# Altium project RP2040.PrjPcb
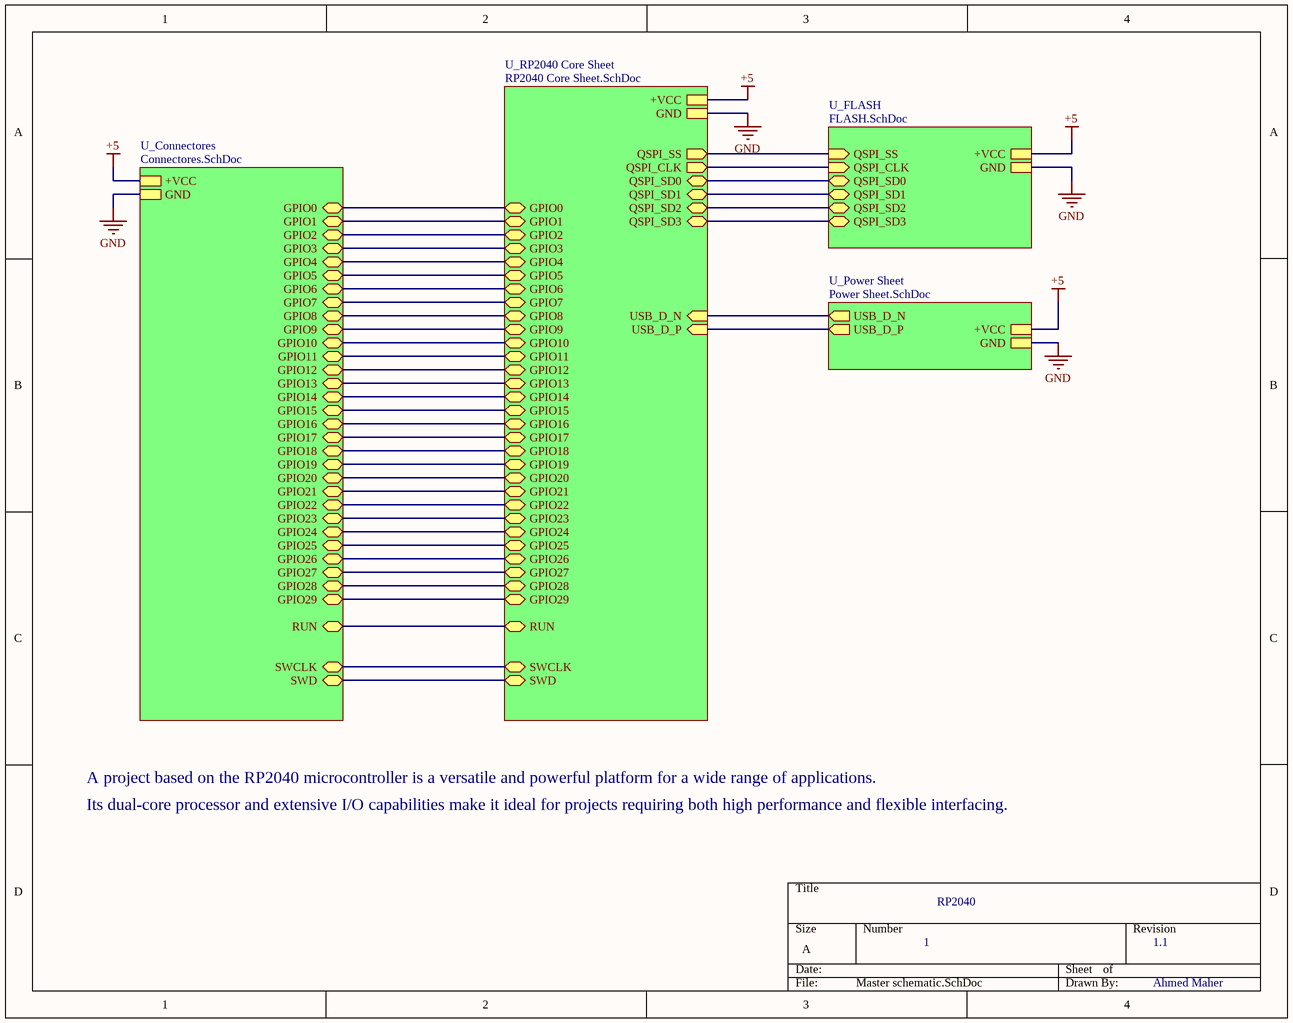
[diagram p0: Master schematic.SchDoc]
5 sheets, 30 parts. Net scope: hierarchical (ports join the sheet entries above them; power ports are global).
Board file: PCB.PcbDoc
Sheets:
  Master schematic.SchDoc
    U_RP2040 Core Sheet = RP2040 Core Sheet.SchDoc
    U_Connectores = Connectores.SchDoc
    U_FLASH = FLASH.SchDoc
    U_Power Sheet = Power Sheet.SchDoc

## Sheet Master schematic.SchDoc
size A; SheetNumber: 1; SheetTotal: 5

### Sub-sheets
U_Connectores = Connectores.SchDoc: +VCC, GND, GPIO0 (bidir), GPIO1 (bidir), GPIO2 (bidir), GPIO3 (bidir), GPIO4 (bidir), GPIO5 (bidir), GPIO6 (bidir), GPIO7 (bidir), GPIO8 (bidir), GPIO9 (bidir), GPIO10 (bidir), GPIO11 (bidir), GPIO12 (bidir), GPIO13 (bidir), GPIO14 (bidir), GPIO15 (bidir), SWCLK (bidir), SWD (bidir), RUN (bidir), GPIO16 (bidir), GPIO18 (bidir), GPIO19 (bidir), GPIO20 (bidir), GPIO21 (bidir), GPIO22 (bidir), GPIO23 (bidir), GPIO24 (bidir), GPIO25 (bidir), GPIO27 (bidir), GPIO28 (bidir), GPIO29 (bidir), GPIO17 (bidir), GPIO26 (bidir)
U_FLASH = FLASH.SchDoc: QSPI_SS (in), QSPI_CLK (in), QSPI_SD0 (bidir), QSPI_SD1 (bidir), QSPI_SD2 (bidir), QSPI_SD3 (bidir), +VCC, GND
U_Power Sheet = Power Sheet.SchDoc: USB_D_P (out), USB_D_N (out), +VCC, GND
U_RP2040 Core Sheet = RP2040 Core Sheet.SchDoc: USB_D_P (in), USB_D_N (in), QSPI_SS (out), QSPI_SD0 (bidir), QSPI_SD1 (bidir), QSPI_SD2 (bidir), QSPI_SD3 (bidir), QSPI_CLK (out), +VCC, GND, GPIO0 (bidir), GPIO1 (bidir), GPIO2 (bidir), GPIO3 (bidir), GPIO4 (bidir), GPIO5 (bidir), GPIO6 (bidir), GPIO7 (bidir), GPIO8 (bidir), GPIO9 (bidir), GPIO10 (bidir), GPIO11 (bidir), GPIO12 (bidir), GPIO13 (bidir), GPIO14 (bidir), GPIO15 (bidir), GPIO16 (bidir), GPIO18 (bidir), GPIO19 (bidir), GPIO20 (bidir), GPIO21 (bidir), GPIO22 (bidir), GPIO23 (bidir), GPIO24 (bidir), GPIO25 (bidir), GPIO17 (bidir), GPIO27 (bidir), GPIO28 (bidir), GPIO29 (bidir), GPIO26 (bidir), RUN (bidir), SWCLK (bidir), SWD (bidir)

### Nets
+5: sheet U_RP2040 Core Sheet/+VCC, sheet U_Connectores/+VCC, sheet U_FLASH/+VCC, sheet U_Power Sheet/+VCC
GND: sheet U_RP2040 Core Sheet/GND, sheet U_Connectores/GND, sheet U_FLASH/GND, sheet U_Power Sheet/GND
GPIO0: sheet U_RP2040 Core Sheet/GPIO0, sheet U_Connectores/GPIO0
GPIO1: sheet U_RP2040 Core Sheet/GPIO1, sheet U_Connectores/GPIO1
GPIO2: sheet U_RP2040 Core Sheet/GPIO2, sheet U_Connectores/GPIO2
GPIO3: sheet U_RP2040 Core Sheet/GPIO3, sheet U_Connectores/GPIO3
GPIO4: sheet U_RP2040 Core Sheet/GPIO4, sheet U_Connectores/GPIO4
GPIO5: sheet U_RP2040 Core Sheet/GPIO5, sheet U_Connectores/GPIO5
GPIO6: sheet U_RP2040 Core Sheet/GPIO6, sheet U_Connectores/GPIO6
GPIO7: sheet U_RP2040 Core Sheet/GPIO7, sheet U_Connectores/GPIO7
GPIO8: sheet U_RP2040 Core Sheet/GPIO8, sheet U_Connectores/GPIO8
GPIO9: sheet U_RP2040 Core Sheet/GPIO9, sheet U_Connectores/GPIO9
GPIO10: sheet U_RP2040 Core Sheet/GPIO10, sheet U_Connectores/GPIO10
GPIO11: sheet U_RP2040 Core Sheet/GPIO11, sheet U_Connectores/GPIO11
GPIO12: sheet U_RP2040 Core Sheet/GPIO12, sheet U_Connectores/GPIO12
GPIO13: sheet U_RP2040 Core Sheet/GPIO13, sheet U_Connectores/GPIO13
GPIO14: sheet U_RP2040 Core Sheet/GPIO14, sheet U_Connectores/GPIO14
GPIO15: sheet U_RP2040 Core Sheet/GPIO15, sheet U_Connectores/GPIO15
GPIO16: sheet U_RP2040 Core Sheet/GPIO16, sheet U_Connectores/GPIO16
GPIO17: sheet U_RP2040 Core Sheet/GPIO17, sheet U_Connectores/GPIO17
GPIO18: sheet U_RP2040 Core Sheet/GPIO18, sheet U_Connectores/GPIO18
GPIO19: sheet U_RP2040 Core Sheet/GPIO19, sheet U_Connectores/GPIO19
GPIO20: sheet U_RP2040 Core Sheet/GPIO20, sheet U_Connectores/GPIO20
GPIO21: sheet U_RP2040 Core Sheet/GPIO21, sheet U_Connectores/GPIO21
GPIO22: sheet U_RP2040 Core Sheet/GPIO22, sheet U_Connectores/GPIO22
GPIO23: sheet U_RP2040 Core Sheet/GPIO23, sheet U_Connectores/GPIO23
GPIO24: sheet U_RP2040 Core Sheet/GPIO24, sheet U_Connectores/GPIO24
GPIO25: sheet U_RP2040 Core Sheet/GPIO25, sheet U_Connectores/GPIO25
GPIO26: sheet U_RP2040 Core Sheet/GPIO26, sheet U_Connectores/GPIO26
GPIO27: sheet U_RP2040 Core Sheet/GPIO27, sheet U_Connectores/GPIO27
GPIO28: sheet U_RP2040 Core Sheet/GPIO28, sheet U_Connectores/GPIO28
GPIO29: sheet U_RP2040 Core Sheet/GPIO29, sheet U_Connectores/GPIO29
QSPI_CLK: sheet U_RP2040 Core Sheet/QSPI_CLK, sheet U_FLASH/QSPI_CLK
QSPI_SD0: sheet U_RP2040 Core Sheet/QSPI_SD0, sheet U_FLASH/QSPI_SD0
QSPI_SD1: sheet U_RP2040 Core Sheet/QSPI_SD1, sheet U_FLASH/QSPI_SD1
QSPI_SD2: sheet U_RP2040 Core Sheet/QSPI_SD2, sheet U_FLASH/QSPI_SD2
QSPI_SD3: sheet U_RP2040 Core Sheet/QSPI_SD3, sheet U_FLASH/QSPI_SD3
QSPI_SS: sheet U_RP2040 Core Sheet/QSPI_SS, sheet U_FLASH/QSPI_SS
RUN: sheet U_RP2040 Core Sheet/RUN, sheet U_Connectores/RUN
SWCLK: sheet U_RP2040 Core Sheet/SWCLK, sheet U_Connectores/SWCLK
SWD: sheet U_RP2040 Core Sheet/SWD, sheet U_Connectores/SWD
USB_D_N: sheet U_RP2040 Core Sheet/USB_D_N, sheet U_Power Sheet/USB_D_N
USB_D_P: sheet U_RP2040 Core Sheet/USB_D_P, sheet U_Power Sheet/USB_D_P

### Notes on the sheet
- A project based on the RP2040 microcontroller is a versatile and powerful platform for a wide range of applications.
- Its dual-core processor and extensive I/O capabilities make it ideal for projects requiring both high performance and flexible interfacing.
- RP2040
- 1
- 1.1
- Ahmed Maher

## Sheet RP2040 Core Sheet.SchDoc
size B; SheetNumber: 3; SheetTotal: 5
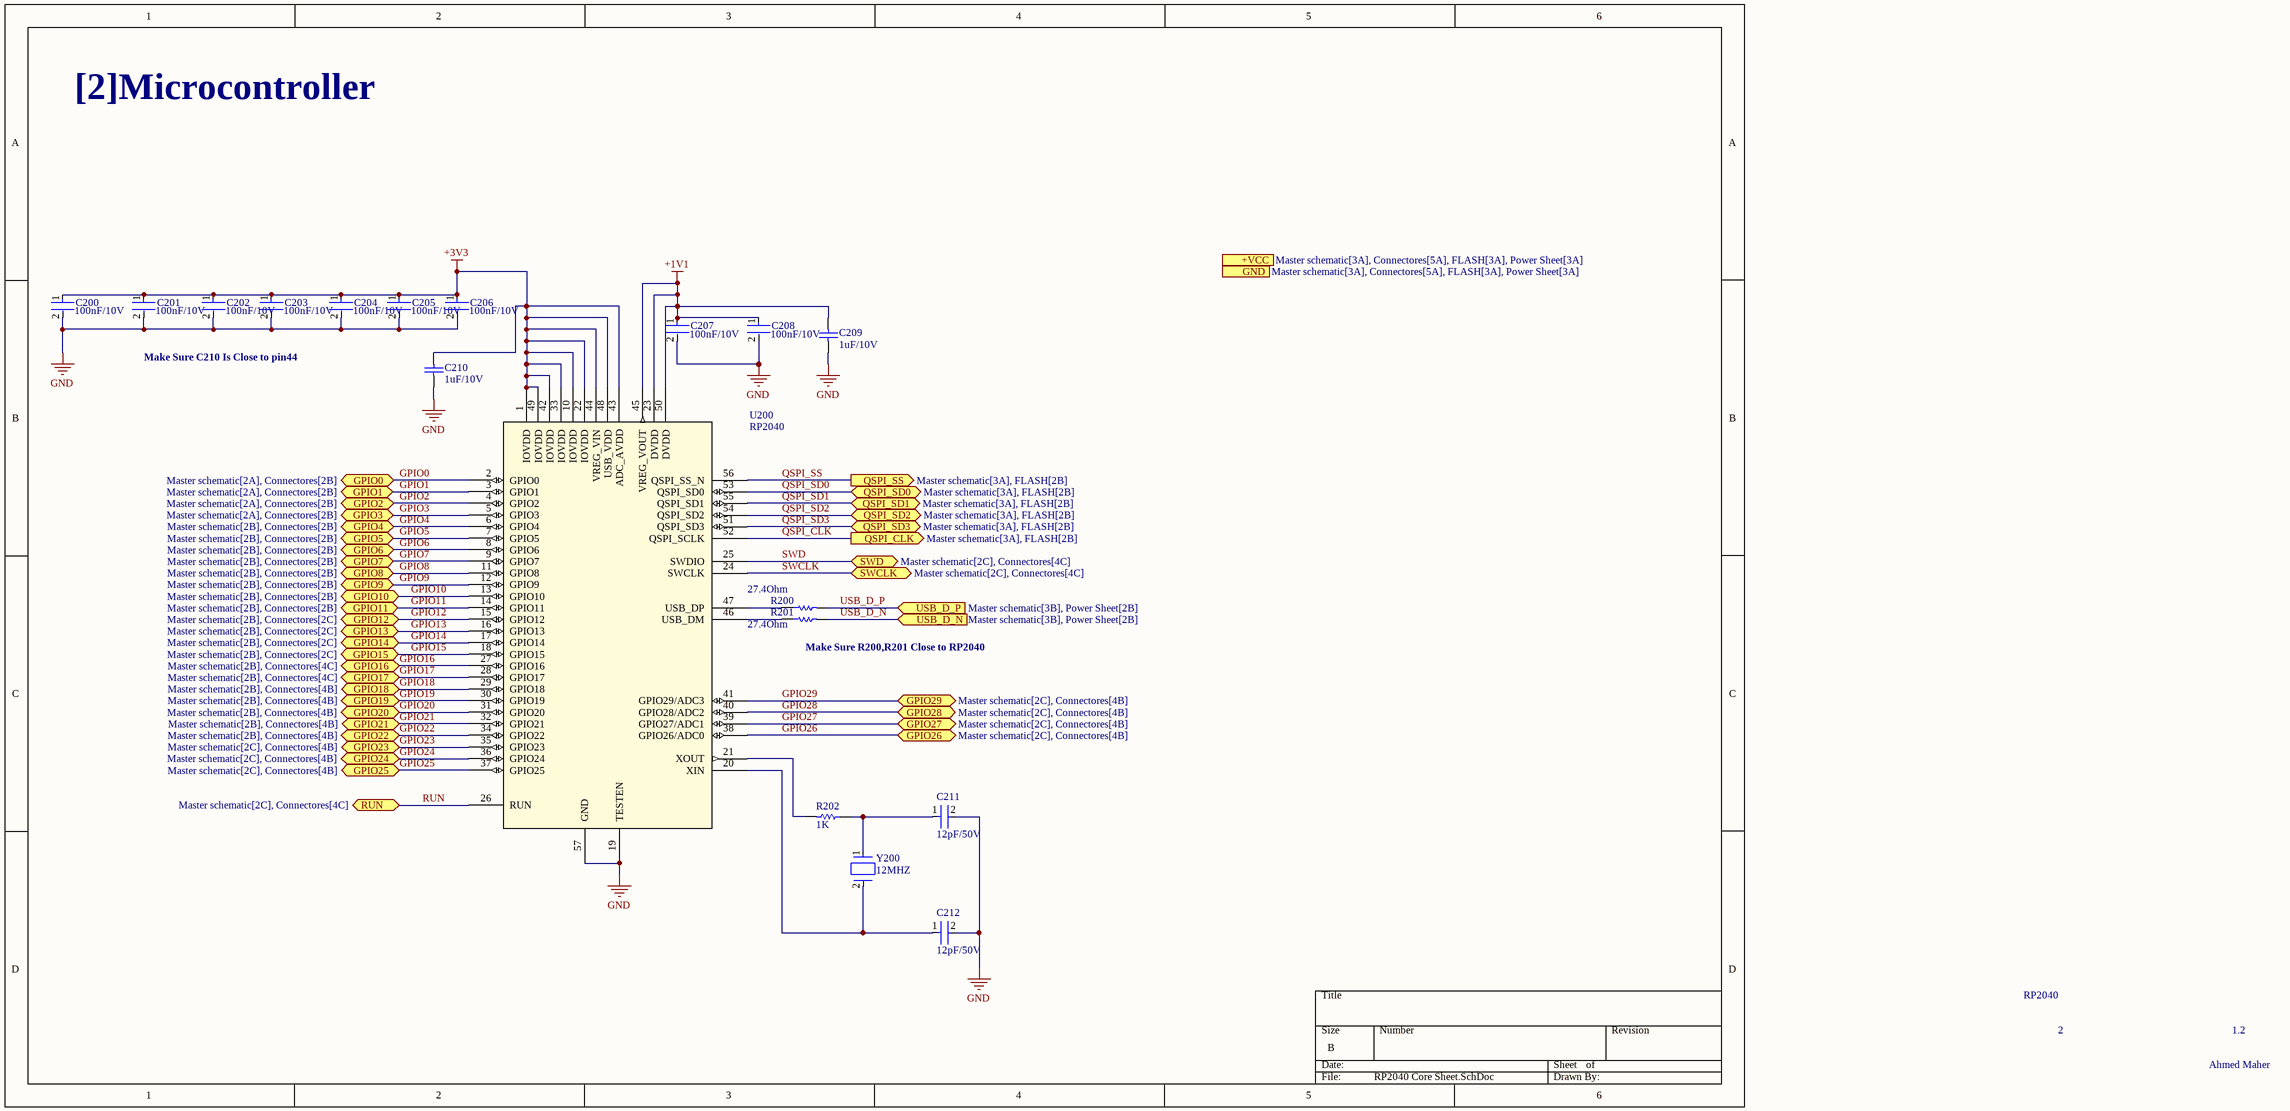
[diagram p1: RP2040 Core Sheet.SchDoc]

### Parts
(Parts that share a designator on the sheet are numbered #1, #2 ... from top to bottom, then left to right.)
C200  C0402C104K8PACTU  [FP-C0402-BB-MFG]  (value not drawn)
C201  C0402C104K8PACTU  [FP-C0402-BB-MFG]  (value not drawn)
C202  C0402C104K8PACTU  [FP-C0402-BB-MFG]  (value not drawn)
C203  C0402C104K8PACTU  [FP-C0402-BB-MFG]  (value not drawn)
C204  C0402C104K8PACTU  [FP-C0402-BB-MFG]  (value not drawn)
C205  C0402C104K8PACTU  [FP-C0402-BB-MFG]  (value not drawn)
C206  C0402C104K8PACTU  [FP-C0402-BB-MFG]  (value not drawn)
C207  C0402C104K8PACTU  [FP-C0402-BB-MFG]  (value not drawn)
C208  C0402C104K8PACTU  [FP-C0402-BB-MFG]  (value not drawn)
C209  1uF/10V  [CAPC1608X87X35LL15T15]
C210  1uF/10V  [CAPC1608X87X35LL15T15]
C211  12pF/50V  [FP-CC0603-0_9-MFG]
C212  12pF/50V  [FP-CC0603-0_9-MFG]
R200  RC0603FR-07274RL  [RESC1608X55X25NL10T15]  (value not drawn)
R201  RC0603FR-07274RL  [RESC1608X55X25NL10T15]  (value not drawn)
R202  1K  [RESC2013X60X35ML10T20]
U200#1  RP2040  [IC57_RP2040]
Y200  12MHZ  [FP-7A-MFG]

### Ports
+VCC (see Master schematic[3A], Connectores[5A], FLASH[3A], Power Sheet[3A]), GND (see Master schematic[3A], Connectores[5A], FLASH[3A], Power Sheet[3A]), GPIO0 (bidir, see Master schematic[2A], Connectores[2B]), GPIO1 (bidir, see Master schematic[2A], Connectores[2B]), GPIO2 (bidir, see Master schematic[2A], Connectores[2B]), GPIO3 (bidir, see Master schematic[2A], Connectores[2B]), GPIO4 (bidir, see Master schematic[2B], Connectores[2B]), GPIO5 (bidir, see Master schematic[2B], Connectores[2B]), GPIO6 (bidir, see Master schematic[2B], Connectores[2B]), GPIO7 (bidir, see Master schematic[2B], Connectores[2B]), GPIO8 (bidir, see Master schematic[2B], Connectores[2B]), GPIO9 (bidir, see Master schematic[2B], Connectores[2B]), GPIO10 (bidir, see Master schematic[2B], Connectores[2B]), GPIO11 (bidir, see Master schematic[2B], Connectores[2B]), GPIO12 (bidir, see Master schematic[2B], Connectores[2C]), GPIO13 (bidir, see Master schematic[2B], Connectores[2C]), GPIO14 (bidir, see Master schematic[2B], Connectores[2C]), GPIO15 (bidir, see Master schematic[2B], Connectores[2C]), GPIO16 (bidir, see Master schematic[2B], Connectores[4C]), GPIO17 (bidir, see Master schematic[2B], Connectores[4C]), GPIO18 (bidir, see Master schematic[2B], Connectores[4B]), GPIO19 (bidir, see Master schematic[2B], Connectores[4B]), GPIO20 (bidir, see Master schematic[2B], Connectores[4B]), GPIO21 (bidir, see Master schematic[2B], Connectores[4B]), GPIO22 (bidir, see Master schematic[2B], Connectores[4B]), GPIO23 (bidir, see Master schematic[2C], Connectores[4B]), GPIO24 (bidir, see Master schematic[2C], Connectores[4B]), GPIO25 (bidir, see Master schematic[2C], Connectores[4B]), GPIO26 (bidir, see Master schematic[2C], Connectores[4B]), GPIO27 (bidir, see Master schematic[2C], Connectores[4B]), GPIO28 (bidir, see Master schematic[2C], Connectores[4B]), GPIO29 (bidir, see Master schematic[2C], Connectores[4B]), QSPI_CLK (out, see Master schematic[3A], FLASH[2B]), QSPI_SD0 (bidir, see Master schematic[3A], FLASH[2B]), QSPI_SD1 (bidir, see Master schematic[3A], FLASH[2B]), QSPI_SD2 (bidir, see Master schematic[3A], FLASH[2B]), QSPI_SD3 (bidir, see Master schematic[3A], FLASH[2B]), QSPI_SS (out, see Master schematic[3A], FLASH[2B]), RUN (bidir, see Master schematic[2C], Connectores[4C]), SWCLK (bidir, see Master schematic[2C], Connectores[4C]), SWD (bidir, see Master schematic[2C], Connectores[4C]), USB_D_N (in, see Master schematic[3B], Power Sheet[2B]), USB_D_P (in, see Master schematic[3B], Power Sheet[2B])

### Nets
+1V1: C207.1 C208.1 C209.1 U200#1.23(DVDD) U200#1.45(VREG_VOUT) U200#1.50(DVDD)
+3V3: C200.1 C201.1 C202.1 C203.1 C204.1 C205.1 C206.1 C210.1 U200#1.1(IOVDD) U200#1.10(IOVDD) U200#1.22(IOVDD) U200#1.33(IOVDD) U200#1.42(IOVDD) U200#1.43(ADC_AVDD) U200#1.44(VREG_VIN) U200#1.48(USB_VDD) U200#1.49(IOVDD)
GND: C200.2 C201.2 C202.2 C203.2 C204.2 C205.2 C206.2 C207.2 C208.2 C209.2 C210.2 C211.2 C212.2 U200#1.19(TESTEN) U200#1.57(GND) ; port GND
GPIO0: U200#1.2(GPIO0) ; port GPIO0
GPIO1: U200#1.3(GPIO1) ; port GPIO1
GPIO2: U200#1.4(GPIO2) ; port GPIO2
GPIO3: U200#1.5(GPIO3) ; port GPIO3
GPIO4: U200#1.6(GPIO4) ; port GPIO4
GPIO5: U200#1.7(GPIO5) ; port GPIO5
GPIO6: U200#1.8(GPIO6) ; port GPIO6
GPIO7: U200#1.9(GPIO7) ; port GPIO7
GPIO8: U200#1.11(GPIO8) ; port GPIO8
GPIO9: U200#1.12(GPIO9) ; port GPIO9
GPIO10: U200#1.13(GPIO10) ; port GPIO10
GPIO11: U200#1.14(GPIO11) ; port GPIO11
GPIO12: U200#1.15(GPIO12) ; port GPIO12
GPIO13: U200#1.16(GPIO13) ; port GPIO13
GPIO14: U200#1.17(GPIO14) ; port GPIO14
GPIO15: U200#1.18(GPIO15) ; port GPIO15
GPIO16: U200#1.27(GPIO16) ; port GPIO16
GPIO17: U200#1.28(GPIO17) ; port GPIO17
GPIO18: U200#1.29(GPIO18) ; port GPIO18
GPIO19: U200#1.30(GPIO19) ; port GPIO19
GPIO20: U200#1.31(GPIO20) ; port GPIO20
GPIO21: U200#1.32(GPIO21) ; port GPIO21
GPIO22: U200#1.34(GPIO22) ; port GPIO22
GPIO23: U200#1.35(GPIO23) ; port GPIO23
GPIO24: U200#1.36(GPIO24) ; port GPIO24
GPIO25: U200#1.37(GPIO25) ; port GPIO25
GPIO26: U200#1.38(GPIO26/ADC0) ; port GPIO26
GPIO27: U200#1.39(GPIO27/ADC1) ; port GPIO27
GPIO28: U200#1.40(GPIO28/ADC2) ; port GPIO28
GPIO29: U200#1.41(GPIO29/ADC3) ; port GPIO29
QSPI_CLK: U200#1.52(QSPI_SCLK) ; port QSPI_CLK
QSPI_SD0: U200#1.53(QSPI_SD0) ; port QSPI_SD0
QSPI_SD1: U200#1.55(QSPI_SD1) ; port QSPI_SD1
QSPI_SD2: U200#1.54(QSPI_SD2) ; port QSPI_SD2
QSPI_SD3: U200#1.51(QSPI_SD3) ; port QSPI_SD3
QSPI_SS: U200#1.56(QSPI_SS_N) ; port QSPI_SS
RUN: U200#1.26(RUN) ; port RUN
SWCLK: U200#1.24(SWCLK) ; port SWCLK
SWD: U200#1.25(SWDIO) ; port SWD
USB_D_N: R201.2 ; port USB_D_N
USB_D_P: R200.2 ; port USB_D_P
NetC211_1: C211.1 R202.1 Y200.1
NetC212_1: C212.1 U200#1.20(XIN) Y200.2
NetR200_1: R200.1 U200#1.47(USB_DP)
NetR201_1: R201.1 U200#1.46(USB_DM)
NetR202_2: R202.2 U200#1.21(XOUT)

### Notes on the sheet
- [2]Microcontroller
- (near C200) 100nF/10V
- 100nF/10V
- (near C203) 100nF/10V
- (near C205) 100nF/10V
- (near C206) 100nF/10V
- Make Sure C210 Is Close to pin44
- (near C207) 100nF/10V
- 27.4Ohm
- Make Sure R200,R201 Close to RP2040
- RP2040
- 2
- Ahmed Maher
- 1.2

### Library data of the parts
C200-C208 = CMP-2008-02046-2: CAP CER 0.1UF 10V X5R 0402; Manufacturer: Kemet; Material: Ceramic; Capacitance: 0.10 μF; Temperature Coefficient: 15%; Tolerance: 0.1; Value: 0.10 μF; Package: C0402-BB; Temperature: -55°C to +125°C; ComponentLink2Description: Datasheet; Temperature Characteristic: X5R; Device Class L1: Passive Components; Height: 0.55mm; Lead Free: Yes; ComponentLink2URL: https://content.kemet.com/datasheets/KEM_C1002_X7R_SMD.pdf; Device Class L2: Capacitors; Temperature Range Low: -55°C; Temperature Range High: +125°C; RoHS: TRUE; Octopart: https://octopart.com/c0402c104k8pactu-kemet-140039; Automotive: No; Mouser Description: Capacitor 100 nF 10 VDC 0402; Category: Cap; Voltage Rating: 10 V; Digikey Description: CAP CER 0.1UF 10V X5R 0402; Ipc Land Pattern Name: CAPC10050X50; Device Class L3: Ceramic Capacitors; Manufacturer Part Number: C0402C104K8PACTU
C209 C210 = CMP-2006-03713-1: Part Number: C0603C105K3RACTU; Manufacturer: Kemet
C211 C212 = CMP-03422-001493-1: CAP CER 15PF 50V C0G/NPO 0603; Insulation Resistance: 100GR; Tolerance: 5%; Dielectric: C0G; Dielectric Material: Ceramic; Series: CC; Height: 0.8mm; Number of Pins: 2; Max Operating Temperature: 125°C; Width: 0.031inch; Length: 1.6mm; Mount: Surface Mount; Packaging: Tape and Reel; RoHS Compliant: Yes; Radiation Hardening: No; Voltage Rating: 50V; Min Operating Temperature: -55°C; Case Code (Imperial): 0603; Case Code (Metric): 1608; Capacitance: 15pF; Termination: SMD/SMT; Lead Free: Lead Free; Depth: 0.8mm; Package Quantity: 1; Thickness: 0.035inch; Case/Package: 0603; REACH SVHC: No SVHC
R200 R201 = CMP-2000-03975-1: Manufacturer: Yageo; Part Number: RC0603FR-07274RL
R202 = CMP-2100-03671-1: Chip Resistor, 1 KOhm, +/- 1%, 125 mW, -55 to 155 degC, 0805 (2012 Metric), RoHS, Tape and Reel; Manufacturer: Yageo; Temperature Coefficient: 100ppm/degreesC; Voltage Rating (DC): 150V; Max Power Dissipation: 125mW; Resistance: 1KOhm; Number of Pins: 2; Number of Terminations: 2; Datasheet URL: http://www.yageo.com/NewPortal/yageodocoutput?fileName=/pdf/R-Chip/PYu-RC_Group_51_RoHS_L_5.pdf; Length: 0.079inch; Package Description: 2-Pin Surface Mounted Device, Body 2 x 1.25 mm; Depth: 1.25mm; Height: 0.024inch; Military Standard: Not; Case/Package: 0805; Package Reference: 0805; RoHSCompliant: true; Lead Free: LeadFree; Packaging: TapeandReel; Package Quantity: 1; Datasheet Version: Rev. 5, 10/2016; Tolerance: 1%; Min Operating Temperature: -55degC; Voltage Rating: 150V; Composition: ThickFilm; Case Code (Imperial): 0805; Power Rating: 125mW; Width: 0.049inch; Case Code (Metric): 2012; Manufacturer URL: http://www.yageo.com/; Max Operating Temperature: 155degC; REACH SVHC: Unknown; Termination: SMD/SMT
U200#1 = RP2040: No Description Available; Manufacturer_Name: Raspberry Pi; Copyright: Copyright (C) 2025 Ultra Librarian. All rights reserved.; Manufacturer_Part_Number: RP2040; RefDes: RefDes; Type: Type
Y200 = CMP-18717-000024-1: Quartz Crystal 12MHz, 30ppm, 12pF, 80Ω; ESR (Equivalent Series Resistance): 80R; Package Quantity: 1; Frequency: 12MHz; Tolerance: 30ppm; Min Operating Temperature: -20°C; Packaging: Tape and Reel; Max Operating Temperature: 85°C; RoHS Compliant: Yes; Frequency Stability: 30ppm; Width: 0.126inch; Number of Pins: 2; Frequency Tolerance: 30ppm; Series: 7A; Load Capacitance: 12pF; Height: 0.053inch; Depth: 3.2mm; Case/Package: SMD/SMT; Lead Free: Contains Lead; Mount: Surface Mount; Length: 5mm; Termination: SMD/SMT

## Sheet Connectores.SchDoc
size B; SheetNumber: 5; SheetTotal: 5
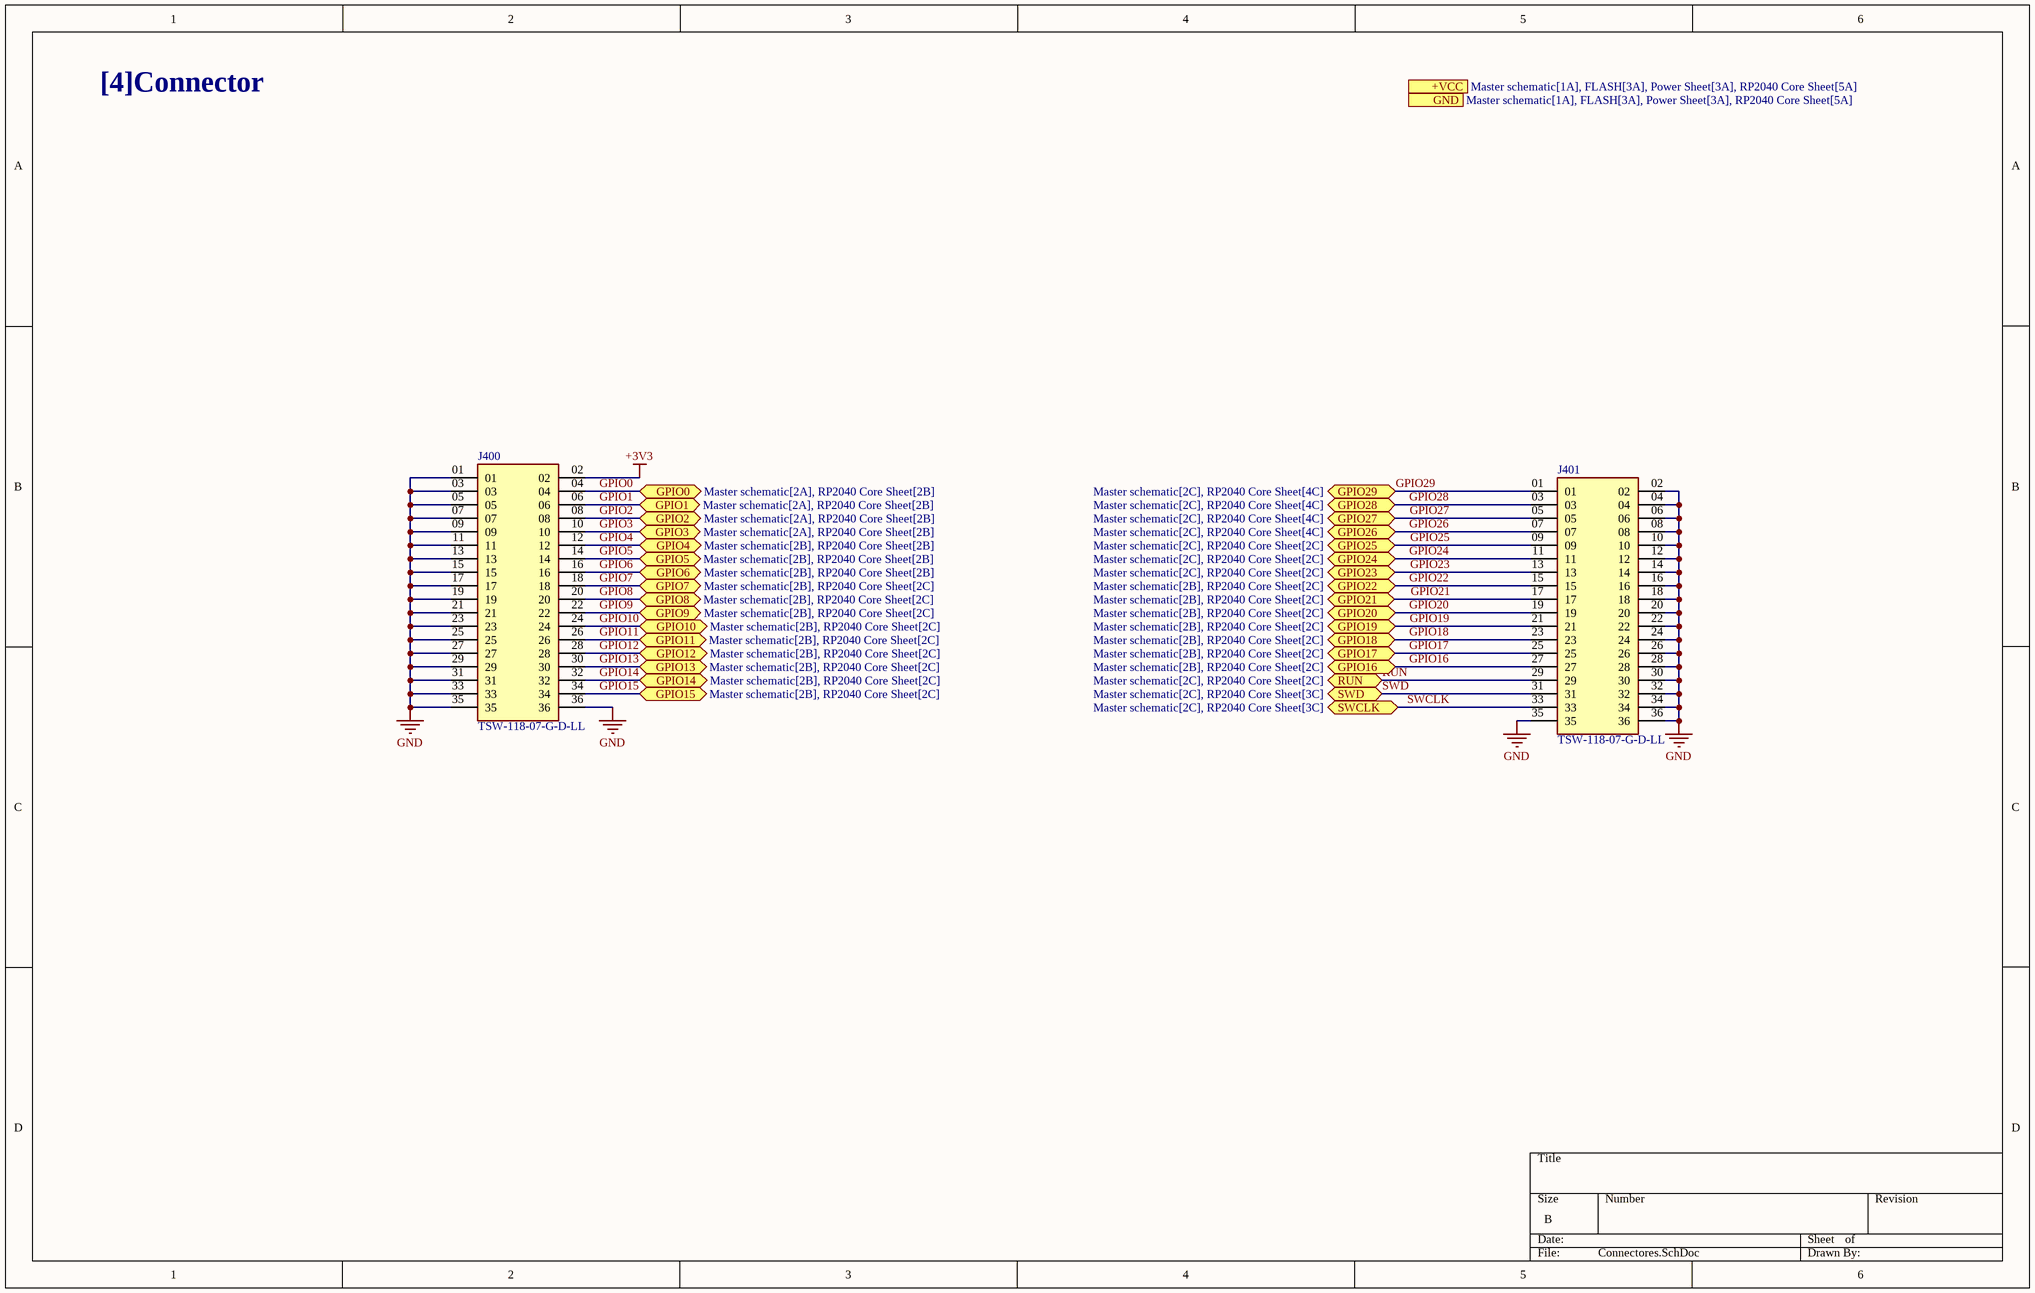
[diagram p2: Connectores.SchDoc]

### Parts
J400  TSW-118-07-G-D-LL  [SAMTEC_TSW-118-07-G-D-LL]
J401  TSW-118-07-G-D-LL  [SAMTEC_TSW-118-07-G-D-LL]

### Ports
+VCC (see Master schematic[1A], FLASH[3A], Power Sheet[3A], RP2040 Core Sheet[5A]), GND (see Master schematic[1A], FLASH[3A], Power Sheet[3A], RP2040 Core Sheet[5A]), GPIO0 (bidir, see Master schematic[2A], RP2040 Core Sheet[2B]), GPIO1 (bidir, see Master schematic[2A], RP2040 Core Sheet[2B]), GPIO2 (bidir, see Master schematic[2A], RP2040 Core Sheet[2B]), GPIO3 (bidir, see Master schematic[2A], RP2040 Core Sheet[2B]), GPIO4 (bidir, see Master schematic[2B], RP2040 Core Sheet[2B]), GPIO5 (bidir, see Master schematic[2B], RP2040 Core Sheet[2B]), GPIO6 (bidir, see Master schematic[2B], RP2040 Core Sheet[2B]), GPIO7 (bidir, see Master schematic[2B], RP2040 Core Sheet[2C]), GPIO8 (bidir, see Master schematic[2B], RP2040 Core Sheet[2C]), GPIO9 (bidir, see Master schematic[2B], RP2040 Core Sheet[2C]), GPIO10 (bidir, see Master schematic[2B], RP2040 Core Sheet[2C]), GPIO11 (bidir, see Master schematic[2B], RP2040 Core Sheet[2C]), GPIO12 (bidir, see Master schematic[2B], RP2040 Core Sheet[2C]), GPIO13 (bidir, see Master schematic[2B], RP2040 Core Sheet[2C]), GPIO14 (bidir, see Master schematic[2B], RP2040 Core Sheet[2C]), GPIO15 (bidir, see Master schematic[2B], RP2040 Core Sheet[2C]), GPIO16 (bidir, see Master schematic[2B], RP2040 Core Sheet[2C]), GPIO17 (bidir, see Master schematic[2B], RP2040 Core Sheet[2C]), GPIO18 (bidir, see Master schematic[2B], RP2040 Core Sheet[2C]), GPIO19 (bidir, see Master schematic[2B], RP2040 Core Sheet[2C]), GPIO20 (bidir, see Master schematic[2B], RP2040 Core Sheet[2C]), GPIO21 (bidir, see Master schematic[2B], RP2040 Core Sheet[2C]), GPIO22 (bidir, see Master schematic[2B], RP2040 Core Sheet[2C]), GPIO23 (bidir, see Master schematic[2C], RP2040 Core Sheet[2C]), GPIO24 (bidir, see Master schematic[2C], RP2040 Core Sheet[2C]), GPIO25 (bidir, see Master schematic[2C], RP2040 Core Sheet[2C]), GPIO26 (bidir, see Master schematic[2C], RP2040 Core Sheet[4C]), GPIO27 (bidir, see Master schematic[2C], RP2040 Core Sheet[4C]), GPIO28 (bidir, see Master schematic[2C], RP2040 Core Sheet[4C]), GPIO29 (bidir, see Master schematic[2C], RP2040 Core Sheet[4C]), RUN (bidir, see Master schematic[2C], RP2040 Core Sheet[2C]), SWCLK (bidir, see Master schematic[2C], RP2040 Core Sheet[3C]), SWD (bidir, see Master schematic[2C], RP2040 Core Sheet[3C])

### Nets
+3V3: J400.02
GND: J400.01 J400.03 J400.05 J400.07 J400.09 J400.11 J400.13 J400.15 J400.17 J400.19 J400.21 J400.23 J400.25 J400.27 J400.29 J400.31 J400.33 J400.35 J400.36 J401.02 J401.04 J401.06 J401.08 J401.10 J401.12 J401.14 J401.16 J401.18 J401.20 J401.22 J401.24 J401.26 J401.28 J401.30 J401.32 J401.34 J401.35 J401.36 ; port GND
GPIO0: J400.04 ; port GPIO0
GPIO1: J400.06 ; port GPIO1
GPIO2: J400.08 ; port GPIO2
GPIO3: J400.10 ; port GPIO3
GPIO4: J400.12 ; port GPIO4
GPIO5: J400.14 ; port GPIO5
GPIO6: J400.16 ; port GPIO6
GPIO7: J400.18 ; port GPIO7
GPIO8: J400.20 ; port GPIO8
GPIO9: J400.22 ; port GPIO9
GPIO10: J400.24 ; port GPIO10
GPIO11: J400.26 ; port GPIO11
GPIO12: J400.28 ; port GPIO12
GPIO13: J400.30 ; port GPIO13
GPIO14: J400.32 ; port GPIO14
GPIO15: J400.34 ; port GPIO15
GPIO16: J401.27 ; port GPIO16
GPIO17: J401.25 ; port GPIO17
GPIO18: J401.23 ; port GPIO18
GPIO19: J401.21 ; port GPIO19
GPIO20: J401.19 ; port GPIO20
GPIO21: J401.17 ; port GPIO21
GPIO22: J401.15 ; port GPIO22
GPIO23: J401.13 ; port GPIO23
GPIO24: J401.11 ; port GPIO24
GPIO25: J401.09 ; port GPIO25
GPIO26: J401.07 ; port GPIO26
GPIO27: J401.05 ; port GPIO27
GPIO28: J401.03 ; port GPIO28
GPIO29: J401.01 ; port GPIO29
RUN: J401.29 ; port RUN
SWCLK: J401.33 ; port SWCLK
SWD: J401.31 ; port SWD

### Notes on the sheet
- [4]Connector

### Library data of the parts
J400 J401 = TSW-118-07-G-D-LL: Package: None; Price: None; Value: *; MP: TSW-118-07-G-D-LL; Availability: Unavailable

## Sheet FLASH.SchDoc
size A; SheetNumber: 4; SheetTotal: 4
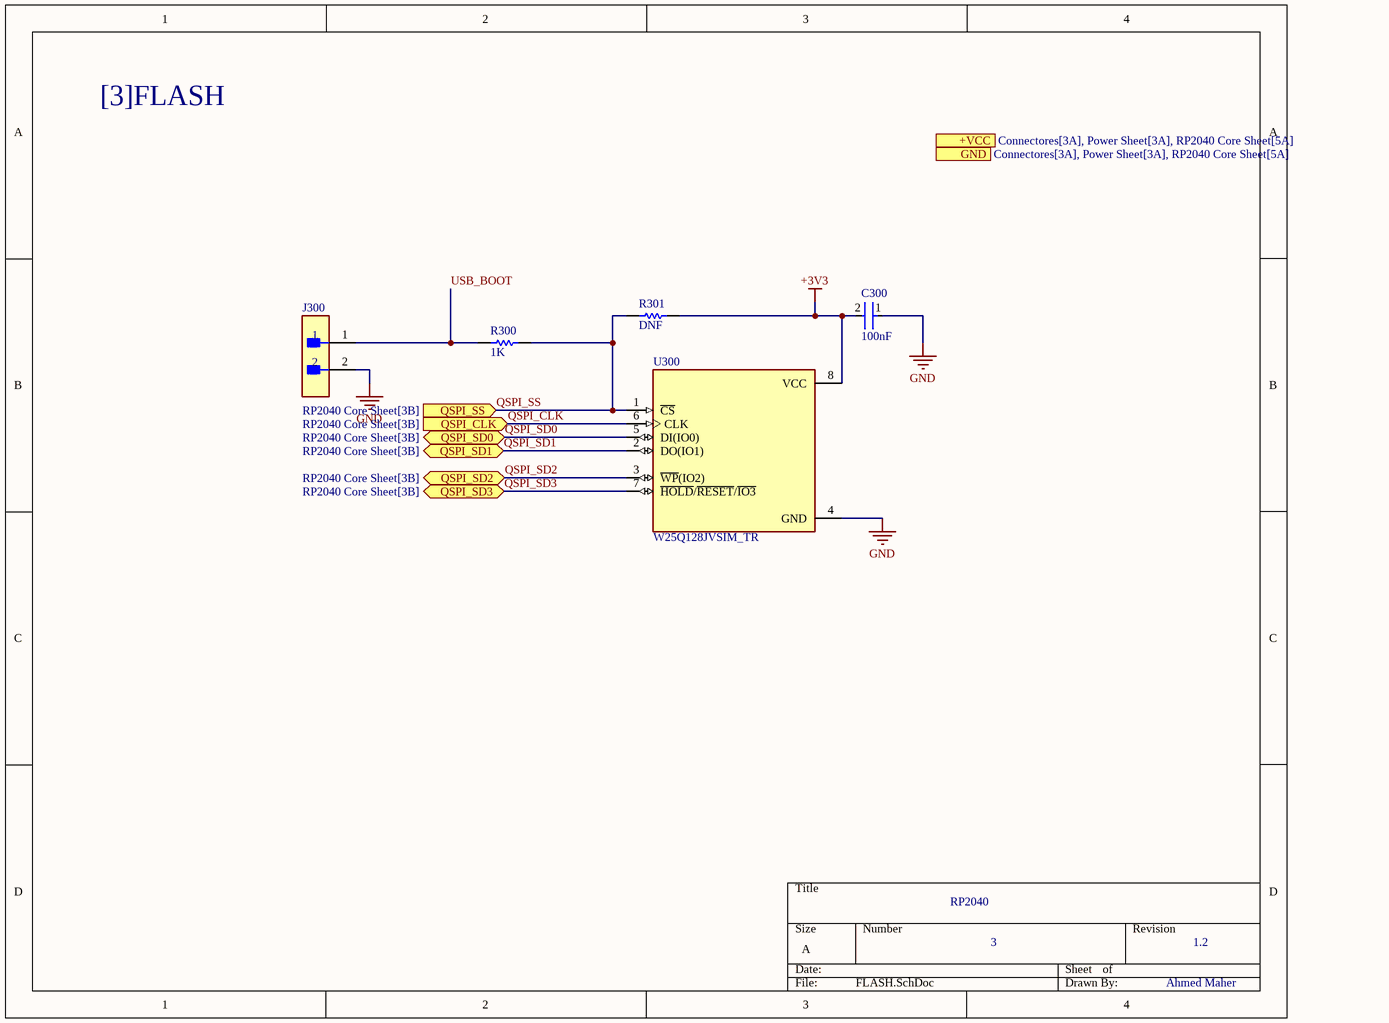
[diagram p3: FLASH.SchDoc]

### Parts
C300  100nF  [FP-CGA3E-0_3-0_1-IPC_A]
J300  M20-9990245  [FP-M20-9990245-MFG]  (value not drawn)
R300  1K  [RESC2013X60X35ML10T20]
R301  DNF  [RESC2013X60X35ML10T20]
U300  W25Q128JVSIM_TR  [SOIC127P790X216-8N]

### Ports
+VCC (see Connectores[3A], Power Sheet[3A], RP2040 Core Sheet[5A]), GND (see Connectores[3A], Power Sheet[3A], RP2040 Core Sheet[5A]), QSPI_CLK (in, see RP2040 Core Sheet[3B]), QSPI_SD0 (bidir, see RP2040 Core Sheet[3B]), QSPI_SD1 (bidir, see RP2040 Core Sheet[3B]), QSPI_SD2 (bidir, see RP2040 Core Sheet[3B]), QSPI_SD3 (bidir, see RP2040 Core Sheet[3B]), QSPI_SS (in, see RP2040 Core Sheet[3B])

### Nets
+3V3: C300.2 R301.2 U300.8(VCC)
GND: C300.1 J300.2 U300.4(GND) ; port GND
QSPI_CLK: U300.6(CLK) ; port QSPI_CLK
QSPI_SD0: U300.5(DI(IO0)) ; port QSPI_SD0
QSPI_SD1: U300.2(DO(IO1)) ; port QSPI_SD1
QSPI_SD2: U300.3(~{WP}(IO2)) ; port QSPI_SD2
QSPI_SD3: U300.7(~{HOLD}/~{RESET}/~{IO3}) ; port QSPI_SD3
QSPI_SS: R300.2 R301.1 U300.1(~{CS}) ; port QSPI_SS
USB_BOOT: J300.1 R300.1

### Notes on the sheet
- [3]FLASH
- RP2040
- 3
- 1.2
- Ahmed Maher

### Library data of the parts
C300 = CMP-2000-07546-2: Cap Ceramic 100nF 50V X7R 10% Pad SMD 0603 +125°C Automotive T/R; Weight: 7.1E-05oz; Composition: Ceramic; Max Operating Temperature: 125°C; Termination: SMD/SMT; Dielectric: X7R; Length: 1.6mm; Package Quantity: 1; REACH SVHC: No SVHC; Lead Free: Lead Free; Case Code (Metric): 1608; Min Operating Temperature: -55°C; Packaging: Tape and Reel; Tolerance: 10%; Voltage Rating: 50V; Case Code (Imperial): 0603; Capacitance: 100nF; Case/Package: 0603; Voltage Rating (DC): 50V; Depth: 0.8mm; Radiation Hardening: No; Ratings: AEC-Q200; Mount: Surface Mount; Voltage: 50V; Thickness: 0.035inch; Width: 0.8mm; Height: 0.8mm
J300 = CMP-15831-000105-1: CONN HEADER VERT 2POS 2.54MM; Working Voltage: 750V; Gender: Male; Number of Poles: 2; Current Rating: 3A; Mated Stacking Heights: 16.54mm; Contact Resistance: 25mR; Connector Type: Male Pin; Insulation Resistance: 10GR; Mating Cycles: 300; Voltage: 50V; Flammability Rating: UL94 V-0; Pitch: 2.54mm; Series: M20; Number of Contacts: 2; Height: 0.12inch; Min Operating Temperature: -40°C; Contact Finish - Mating: GOLD; Number of Positions: 2; Number of Rows: 1; Packaging: Bulk; Package Quantity: 1000; Voltage Rating (AC): 750V; Current: 3A; Mount: Through Hole; Case/Package: SIL; Orientation: Straight; Contact Shape: Square; Weight: 0.25lb; Radiation Hardening: No; Fastening Type: Pull; Length: 5.08mm; Depth: 2.54mm; Contact Mating Length: 0.24inch; Housing Material: Nylon; Reach SVHC Compliant: Yes; Insulation Material: Nylon; Color: Black; Width: 0.25inch; Insulation Color: Black; Contact Material: Brass; Contact Type: Male Pin; Termination: Solder; Max Operating Temperature: 105°C; Contact Plating: Gold; Housing Color: Black; Max Current Rating: 3A; Lead Pitch: 2.54mm
R300 R301 = CMP-2100-03671-1: as R202 on sheet RP2040 Core Sheet; Number of Pins: 2; Number of Terminations: 2; Datasheet URL: http://www.yageo.com/NewPortal/yageodocoutput?fileName=/pdf/R-Chip/PYu-RC_Group_51_RoHS_L_5.pdf; Length: 0.079inch; Package Description: 2-Pin Surface Mounted Device, Body 2 x 1.25 mm; Depth: 1.25mm; Height: 0.024inch; Military Standard: Not; Case/Package: 0805; Package Reference: 0805; RoHSCompliant: true; Lead Free: LeadFree; Packaging: TapeandReel; Package Quantity: 1; Datasheet Version: Rev. 5, 10/2016; Tolerance: 1%; Min Operating Temperature: -55degC; Voltage Rating: 150V; Composition: ThickFilm; Case Code (Imperial): 0805; Power Rating: 125mW; Width: 0.049inch; Case Code (Metric): 2012; Manufacturer URL: http://www.yageo.com/; Max Operating Temperature: 155degC; REACH SVHC: Unknown; Termination: SMD/SMT
U300 = W25Q128JVSIM_TR: FLASH - NOR Memory IC 128Mb (16M x 8) SPI - Quad I/O, QPI, DTR 133 MHz 8-SOIC; MF: Winbond Electronics; MP: W25Q128JVSIM TR; SnapEDA_Link: https://www.snapeda.com/parts/W25Q128JVSIM%20TR/Winbond/view-part/?ref=snap; Package: SOIC-8 Winbond Electronics; Value: *; Check_prices: https://www.snapeda.com/parts/W25Q128JVSIM%20TR/Winbond/view-part/?ref=eda

## Sheet Power Sheet.SchDoc
size A; SheetNumber: 2; SheetTotal: 5
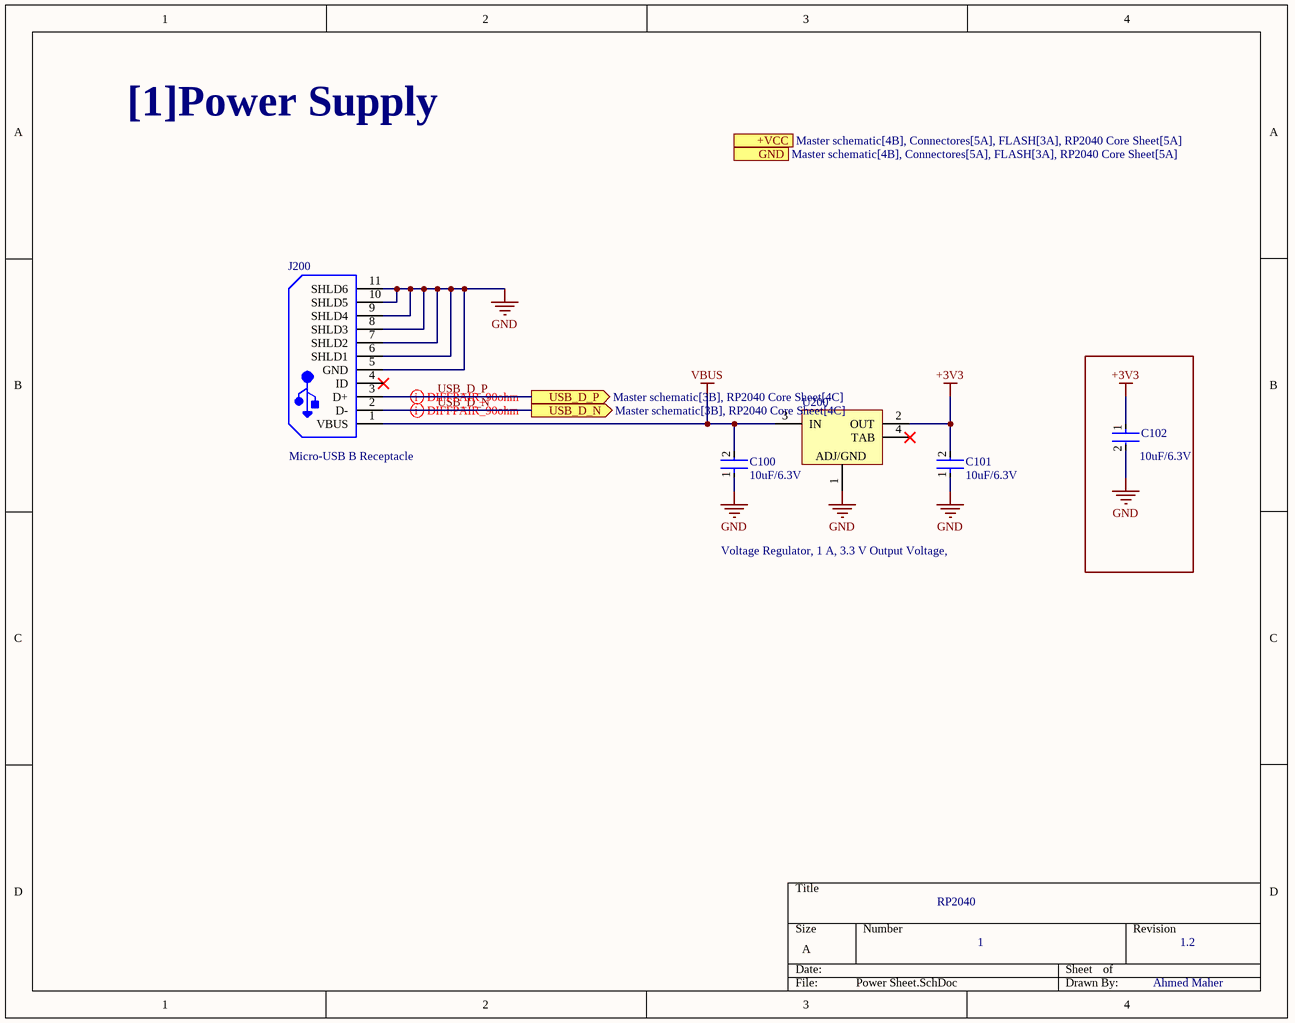
[diagram p4: Power Sheet.SchDoc]

### Parts
(Parts that share a designator on the sheet are numbered #1, #2 ... from top to bottom, then left to right.)
C100  10uF/6.3V  [FP-GRM188-0_1-e0_2_0_55-IPC_A]
C101  10uF/6.3V  [FP-GRM188-0_1-e0_2_0_55-IPC_A]
C102  GRM188R60J106ME47D  [FP-GRM188-0_1-e0_2_0_55-IPC_A]  (value not drawn)
J200  105017-0001  [USB-MICRO-B_V]  (value not drawn)
U200#2  NCP1117ST33T3G  [ONSC-SOT-223-4-318H-01_A_V]  (value not drawn)

### Blocks framed on the sheet
10uF/6.3V: C102

### Ports
+VCC (see Master schematic[4B], Connectores[5A], FLASH[3A], RP2040 Core Sheet[5A]), GND (see Master schematic[4B], Connectores[5A], FLASH[3A], RP2040 Core Sheet[5A]), USB_D_N (out, see Master schematic[3B], RP2040 Core Sheet[4C]), USB_D_P (out, see Master schematic[3B], RP2040 Core Sheet[4C])

### Nets
+3V3: C101.2 C102.1 U200#2.2(OUT)
GND: C100.1 C101.1 C102.2 J200.5(GND) J200.6(SHLD1) J200.7(SHLD2) J200.8(SHLD3) J200.9(SHLD4) J200.10(SHLD5) J200.11(SHLD6) U200#2.1(ADJ/GND) ; port GND
VBUS: C100.2 J200.1(VBUS) U200#2.3(IN)
USB_D_N: J200.2(D-) ; port USB_D_N
USB_D_P: J200.3(D+) ; port USB_D_P

Not connected (* = marked no-connect by the designer): J200 4(ID)*; U200#2 4(TAB)*

### Layout directives
differential pair; differential pair class USB_90R: USB_D_N, USB_D_P

### Notes on the sheet
- [1]Power Supply
- (near J200) Micro-USB B Receptacle
- Voltage Regulator, 1 A, 3.3 V Output Voltage,
- RP2040
- 1
- 1.2
- Ahmed Maher

### Library data of the parts
C100-C102 = CMP-2006-02792-2: Chip Multilayer Ceramic Capacitors for General Purpose, 0603, 10uF, X5R, 15%, 20%, 6.3V; Packaging: Tape and Reel; Voltage Rating (DC): 6.3V; Width: 0.031inch; Termination: SMD/SMT; Dielectric: X5R; Package Quantity: 4000; Voltage Rating: 6.3V; Capacitance: 10uF; Case/Package: 0603; Min Operating Temperature: -55°C; Voltage: 6.3V; Length: 1.6mm; Thickness: 0.035inch; Lead Free: Lead Free; Depth: 0.8mm; Case Code (Imperial): 0603; Max Operating Temperature: 85°C; Material: Ceramic; Height: 0.8mm; Tolerance: 20%; Mount: Surface Mount; REACH SVHC: No SVHC; Radiation Hardening: No; Case Code (Metric): 1608
J200 = CMP-2000-05827-1: Micro-USB B Receptacle, Right Angle, Bottom Mount, Surface Mount, with Solder Tabs, -30 to 85 degC, 5-Pin USB, RoHS, Tape and Reel; Manufacturer: Molex; Featured Product: Micro-USBConnectorsUSBConnectors; Other Names: WM1399DKR; Package Version: Rev. F, 12/2012; Number of Contacts: 5; Connector Type: USB-microB; Catalog Drawings: 1050170001; 3D Model: 105017-0001.stp; Mating Products: WM17145-ND-CABLEMICROUSBBTOSTDA1.0MWM17147-ND-CABLEMICROUSBBTOSTDA2.0MWM17146-ND-CABLEMICROUSBBTOSTDA1.5M; PCN Assembly/Origin: ResinSupplier21/Oct/2015; Voltage - Max: 30V; Online Catalog: Molex-MicroUSB; Manufacturer URL: http://www.molex.com/; Package Description: 5-Leads USB, Micro B, Body 7.5 x 5 mm, Pitch 0.65 mm; Datasheet URL: http://www.molex.com/elqNow/elqRedir.htm?ref=http://www.molex.com/webdocs/datasheets/pdf/en-us/1050170001_IO_CONNECTORS.pdf; Ingress Protection: -; Datasheet Version: 03/2016; Mounting Type: BoardCutout,SurfaceMount,RightAngle; Circuits: 5; Standard Package: 1; Package Reference: MICRO-B; Package URL: http://www.molex.com/pdm_docs/sd/1050170001_sd.pdf; Category: Connectors,Interconnects; Series: -; RoHS Information: 1050170001CertofCompliance; Features: Shielded,SolderRetention; Family: USB,DVI,HDMIConnectors; Specifications: -; Gender: Receptacle; Packaging: Digi-Reel®; Mounting Technology: SurfaceMount
U200#2 = CMP-1679-00010-1: Low-Dropout Positive Fixed Voltage Regulator, 1 A, 3.3 V Output Voltage, 0 to 125 degC, 4-Pin SOT-223 (318H-01), Pb-Free, Tape and Reel; Resistance: 220 kohm; Type (Resistor): Thick Film; Voltage Rating: 75 V; Tolerance: 1%; Case\Package: 0603; Power Rating: 100 mW; Width: 0.85 mm; Weight: 7.1E-05 oz; ComponentLink2URL: http://www.onsemi.com/pub_link/Collateral/NCP1117-D.PDF; RoHSCompliant: true; Height: 0.45 mm; PackageDescription: 4-Pin Small Outline Transistor, Body 6.5 x 3.5 mm, Pitch 2.3 mm; ComponentLink1Description: Manufacturer URL; ComponentLink1URL: http://www.onsemi.com/; PackageReference: SOT-223-4-318H-01_A; Max Operating Temperature: 155 degC; Packaging: Tape and Reel; REACH SVHC: Unknown; Length: 1.55 mm; Package Quantity: 5000; Radiation Hardening: No; Min Operating Temperature: -55 degC; DatasheetVersion: Rev. 27, 09/2014; Mount: Surface Mount; Case Code (Imperial): 0603; Case Code (Metric): 1608; ComponentLink2Description: Datasheet

## Nets that join several sheets
+3V3: RP2040 Core Sheet (17 pins), Connectores (J400.02), FLASH (C300.2 R301.2 U300.8), Power Sheet (C101.2 C102.1 U200#2.2)
GND: RP2040 Core Sheet (15 pins), Connectores (38 pins), FLASH (C300.1 J300.2 U300.4), Power Sheet (11 pins)
GPIO0: RP2040 Core Sheet (U200#1.2), Connectores (J400.04)
GPIO1: RP2040 Core Sheet (U200#1.3), Connectores (J400.06)
GPIO2: RP2040 Core Sheet (U200#1.4), Connectores (J400.08)
GPIO3: RP2040 Core Sheet (U200#1.5), Connectores (J400.10)
GPIO4: RP2040 Core Sheet (U200#1.6), Connectores (J400.12)
GPIO5: RP2040 Core Sheet (U200#1.7), Connectores (J400.14)
GPIO6: RP2040 Core Sheet (U200#1.8), Connectores (J400.16)
GPIO7: RP2040 Core Sheet (U200#1.9), Connectores (J400.18)
GPIO8: RP2040 Core Sheet (U200#1.11), Connectores (J400.20)
GPIO9: RP2040 Core Sheet (U200#1.12), Connectores (J400.22)
GPIO10: RP2040 Core Sheet (U200#1.13), Connectores (J400.24)
GPIO11: RP2040 Core Sheet (U200#1.14), Connectores (J400.26)
GPIO12: RP2040 Core Sheet (U200#1.15), Connectores (J400.28)
GPIO13: RP2040 Core Sheet (U200#1.16), Connectores (J400.30)
GPIO14: RP2040 Core Sheet (U200#1.17), Connectores (J400.32)
GPIO15: RP2040 Core Sheet (U200#1.18), Connectores (J400.34)
GPIO16: RP2040 Core Sheet (U200#1.27), Connectores (J401.27)
GPIO17: RP2040 Core Sheet (U200#1.28), Connectores (J401.25)
GPIO18: RP2040 Core Sheet (U200#1.29), Connectores (J401.23)
GPIO19: RP2040 Core Sheet (U200#1.30), Connectores (J401.21)
GPIO20: RP2040 Core Sheet (U200#1.31), Connectores (J401.19)
GPIO21: RP2040 Core Sheet (U200#1.32), Connectores (J401.17)
GPIO22: RP2040 Core Sheet (U200#1.34), Connectores (J401.15)
GPIO23: RP2040 Core Sheet (U200#1.35), Connectores (J401.13)
GPIO24: RP2040 Core Sheet (U200#1.36), Connectores (J401.11)
GPIO25: RP2040 Core Sheet (U200#1.37), Connectores (J401.09)
GPIO26: RP2040 Core Sheet (U200#1.38), Connectores (J401.07)
GPIO27: RP2040 Core Sheet (U200#1.39), Connectores (J401.05)
GPIO28: RP2040 Core Sheet (U200#1.40), Connectores (J401.03)
GPIO29: RP2040 Core Sheet (U200#1.41), Connectores (J401.01)
QSPI_CLK: RP2040 Core Sheet (U200#1.52), FLASH (U300.6)
QSPI_SD0: RP2040 Core Sheet (U200#1.53), FLASH (U300.5)
QSPI_SD1: RP2040 Core Sheet (U200#1.55), FLASH (U300.2)
QSPI_SD2: RP2040 Core Sheet (U200#1.54), FLASH (U300.3)
QSPI_SD3: RP2040 Core Sheet (U200#1.51), FLASH (U300.7)
QSPI_SS: RP2040 Core Sheet (U200#1.56), FLASH (R300.2 R301.1 U300.1)
RUN: RP2040 Core Sheet (U200#1.26), Connectores (J401.29)
SWCLK: RP2040 Core Sheet (U200#1.24), Connectores (J401.33)
SWD: RP2040 Core Sheet (U200#1.25), Connectores (J401.31)
USB_D_N: RP2040 Core Sheet (R201.2), Power Sheet (J200.2)
USB_D_P: RP2040 Core Sheet (R200.2), Power Sheet (J200.3)